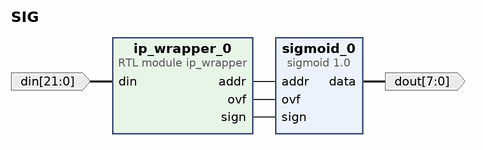
[diagram p0: block diagram of the top level]
# Vivado block design SIG, xc7a12tcpg238-3, Vivado 2022.1.2
create_bd_design SIG

create_bd_port -dir I -from 21 -to 0 din
create_bd_port -dir O -from 7 -to 0 dout

create_bd_cell -type module -reference ip_wrapper ip_wrapper_0
create_bd_cell -type ip -vlnv siu.edu:user:sigmoid:1.0 sigmoid_0

# ---- connections ----

connect_bd_net [get_bd_ports din] [get_bd_pins ip_wrapper_0/din]
connect_bd_net [get_bd_pins ip_wrapper_0/addr] [get_bd_pins sigmoid_0/addr]
connect_bd_net [get_bd_pins ip_wrapper_0/ovf] [get_bd_pins sigmoid_0/ovf]
connect_bd_net [get_bd_pins ip_wrapper_0/sign] [get_bd_pins sigmoid_0/sign]
connect_bd_net [get_bd_pins sigmoid_0/data] [get_bd_ports dout]

validate_bd_design
save_bd_design
